# Altium schematic sheet 12_Supply.SchDoc: 12V Supply
size OrCAD A; DocumentNumber: YT-002; Revision: -
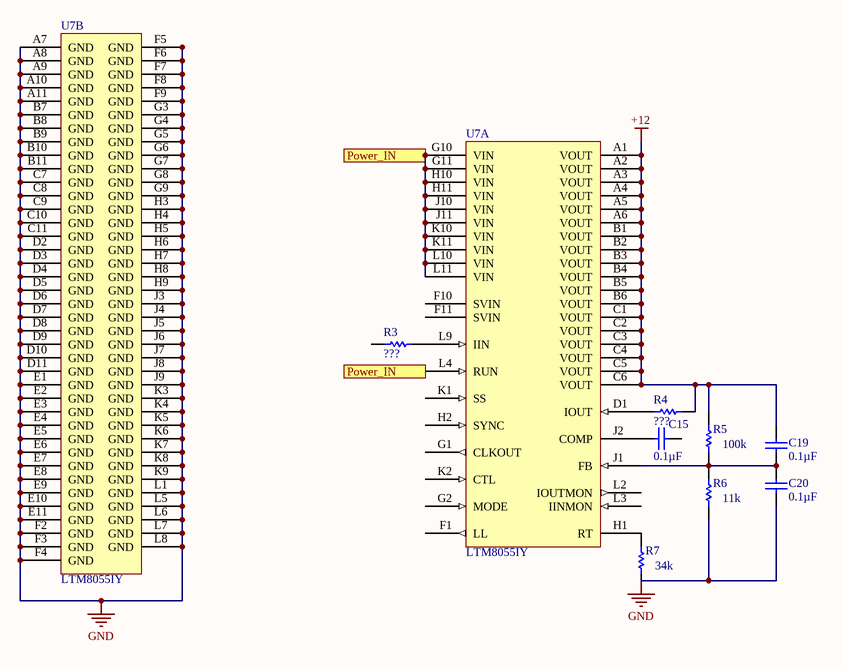
[diagram p0: 12_Supply.SchDoc]

## Parts
C15  Capacitance: 0.1µF  [CAPC0805(2012)145_N]  (hidden comment: CAP CER 0.1UF 16V X7R 0805)
C19  Capacitance: 0.1µF  [CAPC0805(2012)145_N]  (hidden comment: CAP CER 0.1UF 16V X7R 0805)
C20  Capacitance: 0.1µF  [CAPC0805(2012)145_N]  (hidden comment: CAP CER 0.1UF 16V X7R 0805)
R3  ???  [RESC0402(1005)_L]
R4  ???  [RESC0402(1005)_L]
R5  100k  [RESC0402(1005)_L]
R6  11k  [RESC0402(1005)_L]
R7  34k  [RESC0402(1005)_L]
U7  LTM8055IY  [LT-BGA-121-15000X15000X4920]  (parts A,B of 2)

## Ports
Power_IN

## Nets
+12: C19.2 R4.1 R5.2 U7.A1(VOUT) U7.A2(VOUT) U7.A3(VOUT) U7.A4(VOUT) U7.A5(VOUT) U7.A6(VOUT) U7.B1(VOUT) U7.B2(VOUT) U7.B3(VOUT) U7.B4(VOUT) U7.B5(VOUT) U7.B6(VOUT) U7.C1(VOUT) U7.C2(VOUT) U7.C3(VOUT) U7.C4(VOUT) U7.C5(VOUT) U7.C6(VOUT)
GND: C20.1 R6.1 U7.A7(GND) U7.A8(GND) U7.A9(GND) U7.A10(GND) U7.A11(GND) U7.B7(GND) U7.B8(GND) U7.B9(GND) U7.B10(GND) U7.B11(GND) U7.C7(GND) U7.C8(GND) U7.C9(GND) U7.C10(GND) U7.C11(GND) U7.D2(GND) U7.D3(GND) U7.D4(GND) U7.D5(GND) U7.D6(GND) U7.D7(GND) U7.D8(GND) U7.D9(GND) U7.D10(GND) U7.D11(GND) U7.E1(GND) U7.E2(GND) U7.E3(GND) U7.E4(GND) U7.E5(GND) U7.E6(GND) U7.E7(GND) U7.E8(GND) U7.E9(GND) U7.E10(GND) U7.E11(GND) U7.F2(GND) U7.F3(GND) U7.F4(GND) U7.F5(GND) U7.F6(GND) U7.F7(GND) U7.F8(GND) U7.F9(GND) U7.G3(GND) U7.G4(GND) U7.G5(GND) U7.G6(GND) U7.G7(GND) U7.G8(GND) U7.G9(GND) U7.H3(GND) U7.H4(GND) U7.H5(GND) U7.H6(GND) U7.H7(GND) U7.H8(GND) U7.H9(GND) U7.J3(GND) U7.J4(GND) U7.J5(GND) U7.J6(GND) U7.J7(GND) U7.J8(GND) U7.J9(GND) U7.K3(GND) U7.K4(GND) U7.K5(GND) U7.K6(GND) U7.K7(GND) U7.K8(GND) U7.K9(GND) U7.L1(GND) U7.L5(GND) U7.L6(GND) U7.L7(GND) U7.L8(GND)
Power_IN: U7.G10(VIN) U7.G11(VIN) U7.H10(VIN) U7.H11(VIN) U7.J10(VIN) U7.J11(VIN) U7.K10(VIN) U7.K11(VIN) U7.L4(RUN) U7.L10(VIN) U7.L11(VIN) ; port Power_IN
NetC15_1: C15.1 U7.J2(COMP)
NetC19_1: C19.1 C20.2 R5.1 R6.2 U7.J1(FB)
NetR3_1: R3.1 U7.L9(IIN)
NetR4_2: R4.2 U7.D1(IOUT)
NetR7_2: R7.2 U7.H1(RT)

Not connected (* = marked no-connect by the designer): C15 2; R3 2; R7 1; U7 F1(LL) F10(SVIN) F11(SVIN) G1(CLKOUT) G2(MODE) H2(SYNC) K1(SS) K2(CTL) L2(IOUTMON) L3(IINMON)

## Notes on the sheet
- Title
- Size:
- Date:
- Orcad A
- Number:
- Time:
- Revision:
- Sheet
- of
- ZLS Corporation
- 7801 North Lamar Blvd.
- Suite E-184
- Austin, Texas 78752  USA
- (512) 453-0288
- File:

## Library data of the parts
C15 C19 C20 = CMP-1036-04795-1: Manufacturer: Murata Electronics North America; Manufacturer Part Number: GRM219R71C104KA01D; Tolerance: ±10%; Voltage - Rated: 25V; Supplier Part Number 1: 490-1673-6-ND; Temperature Coefficient: X7R; Thickness (Max): 0.053" (1.35mm); Supplier 2: Digi-Key; Supplier Part Number 2: 490-1683-6-ND; RoHS: RoHS Compliant; Category: Capacitors; Stock 2: 245331; Pricing 2: 1=0.14, 10=0.098, 100=0.0462, 500=0.0324, 1000=0.02683 (USD); Packaging: Digi-Reel®; Part Status: Active; Operating Temperature: -55°C ~ 125°C; Features: -; Ratings: -; Applications: General Purpose; Mounting Type: Surface Mount, MLCC; Package / Case: 0805 (2012 Metric); Size / Dimension: 0.079" L x 0.049" W (2.00mm x 1.25mm); Height - Seated (Max): -; Lead Spacing: -; Lead Style: -; ComponentLink1URL: http://www.murata.com/~/media/webrenewal/support/library/catalog/products/capacitor/mlcc/c02e.ashx; ComponentLink1Description: http://www.murata.com/~/media/webrenewal/support/library/catalog/products/capacitor/mlcc/c02e.ashx
R3-R7 = CMP-1011-00927-1: Tolerance: ±1%; Temperature Coefficient: ±100ppm/°C; Supplier Part Number 1: YAG3220CT-ND; Supplier Device Package: 0402
U7 = CMP-2000-06614-1: Buck-Boost uModule Regulator, 8.5 A, 5 to 36 V, -40 to 125 degC, 121-Ball BGA, RoHS, Tray; Manufacturer: LinearTechnology; Current - Output (Max): 8.5A; Number of Outputs: 1; Efficiency: 97.5%; Voltage - Input (Max): 36V; Package Version: Rev. A, 11/2012; Voltage - Output 1: 1.2~36V; Voltage - Input (Min): 5V; Operating Temperature: -40°C~125°C; Voltage - Output 3: -; Datasheet Version: Rev. A, 01/2016; Power (Watts) - Manufacture Series: -; Series: µModule®; Manufacturer URL: http://www.linear.com/; Datasheet URL: http://cds.linear.com/docs/en/datasheet/8055fa.pdf; Type: Non-IsolatedPoLModule; Voltage - Output 2: -; Mounting Type: SurfaceMount; Packaging: Tray; Mounting Technology: SurfaceMount; Package URL: http://www.linear.com/docs/41075; Features: OTP; Power (Watts) - Max: -; Package Reference: BGA-121; Category: PowerSupplies-BoardMount; Package / Case: 121-BGA; Voltage - Isolation: -; Package Description: 121-Ball BGA, Body 15 x 15 mm, Pitch 1.27 mm; Applications: ITE(Commercial); Family: DCDCConverters; PartId: 1